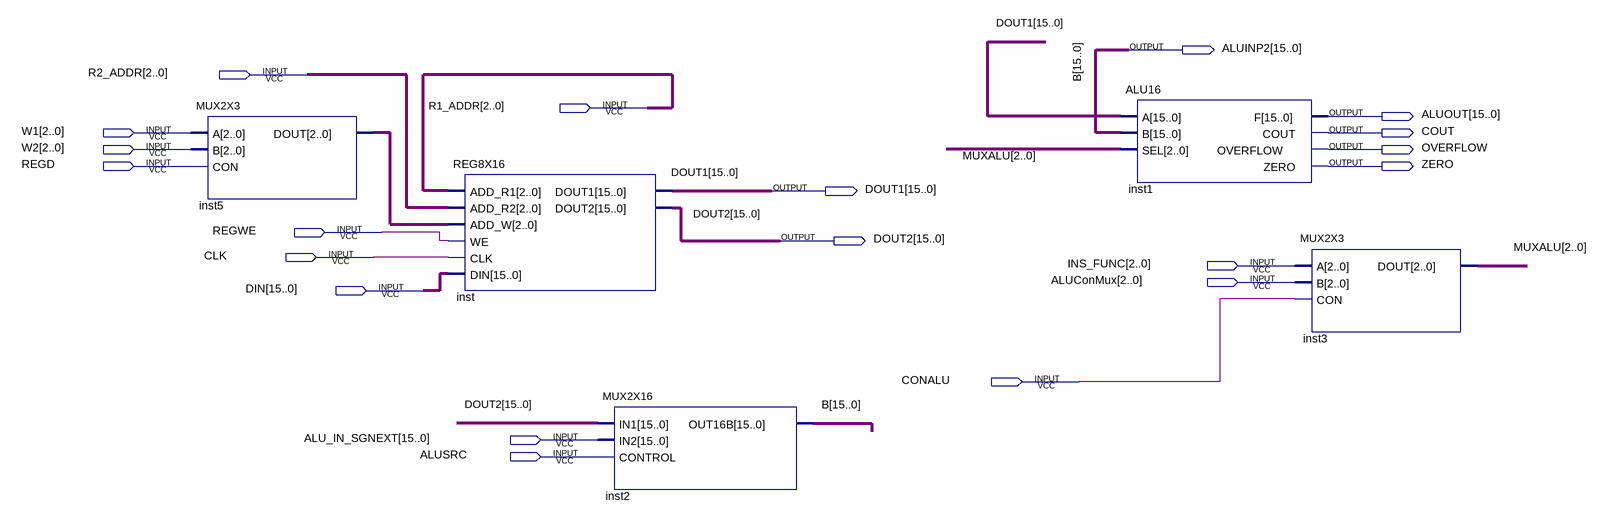
[diagram p0: schematic sheet]
// Quartus schematic m16dp2.bdf as structural Verilog: 5 symbols, 20 pins
module m16dp2 (
  input  [2:0] R2_ADDR,
  input  [2:0] R1_ADDR,
  input  [2:0] W1,
  input  [2:0] W2,
  input  REGD,
  input  REGWE,
  input  CLK,
  input  [2:0] INS_FUNC,
  input  [2:0] ALUConMux,
  input  [15:0] DIN,
  input  CONALU,
  input  [15:0] ALU_IN_SGNEXT,
  input  ALUSRC,
  output [15:0] ALUINP2,
  output [15:0] ALUOUT,
  output COUT,
  output OVERFLOW,
  output ZERO,
  output [15:0] DOUT1,
  output [15:0] DOUT2
);

  wire [2:0] inst5_dout, MUXALU;

  MUX2X3 inst5 (.A(W1), .B(W2), .CON(REGD), .DOUT(inst5_dout));
  REG8X16 inst (
    .ADD_R1(R1_ADDR), .ADD_R2(R2_ADDR), .ADD_W(inst5_dout), .WE(REGWE), .CLK(CLK), .DIN(DIN), .DOUT1(DOUT1),
    .DOUT2(DOUT2));
  MUX2X16 inst2 (.IN1(DOUT2), .IN2(ALU_IN_SGNEXT), .CONTROL(ALUSRC), .OUT16B(ALUINP2));
  ALU16 inst1 (.A(DOUT1), .B(ALUINP2), .SEL(MUXALU), .F(ALUOUT), .COUT(COUT), .OVERFLOW(OVERFLOW), .ZERO(ZERO));
  MUX2X3 inst3 (.A(INS_FUNC), .B(ALUConMux), .CON(CONALU), .DOUT(MUXALU));

  // Other names for the same wires on the sheet: B[15:0] = ALUINP2
endmodule
